# Altium project Dexter Pac.PrjPcb
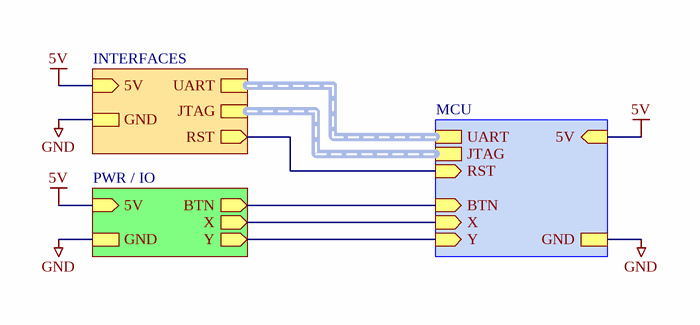
[diagram p0: Main.SchDoc]
Revision: 1
4 sheets, 50 parts. Net scope: hierarchical (ports join the sheet entries above them; power ports are global).
Board file: DexCon.PcbDoc
Sheets:
  Main.SchDoc
    MCU = MCU.SchDoc
    PWR / IO = INPUT.SchDoc
    INTERFACES = INTERFACE.SchDoc

## Sheet Main.SchDoc
size Letter; Revision: 1; SheetNumber: 1; SheetTotal: 4

### Sub-sheets
INTERFACES = INTERFACE.SchDoc: GND, 5V (in), UART (harness MCU_UART), RST (out), JTAG (harness MCU_SPI)
MCU = MCU.SchDoc: GND, 5V (in), X (in), BTN (in), Y (in), UART (harness MCU_UART), JTAG (harness MCU_SPI), RST (in)
PWR / IO = INPUT.SchDoc: GND, 5V (in), X (out), BTN (out), Y (out)

### Nets
5V: sheet MCU/5V, sheet PWR / IO/5V, sheet INTERFACES/5V
GND: sheet MCU/GND, sheet PWR / IO/GND, sheet INTERFACES/GND
RST: sheet MCU/RST, sheet INTERFACES/RST
NetC12_1: sheet MCU/BTN, sheet PWR / IO/BTN
NetR1_2: sheet MCU/X, sheet PWR / IO/X
NetR2_2: sheet MCU/Y, sheet PWR / IO/Y

### Buses and harness runs
harness sheet INTERFACES/JTAG = sheet MCU/JTAG
harness sheet INTERFACES/UART = sheet MCU/UART

### Notes on the sheet
- SHEET
- REVISION
- OF
- PROJECT
- REVIEWER
- ENGINEER
- DATE

## Sheet MCU.SchDoc
size Letter; SheetNumber: 2; SheetTotal: 4
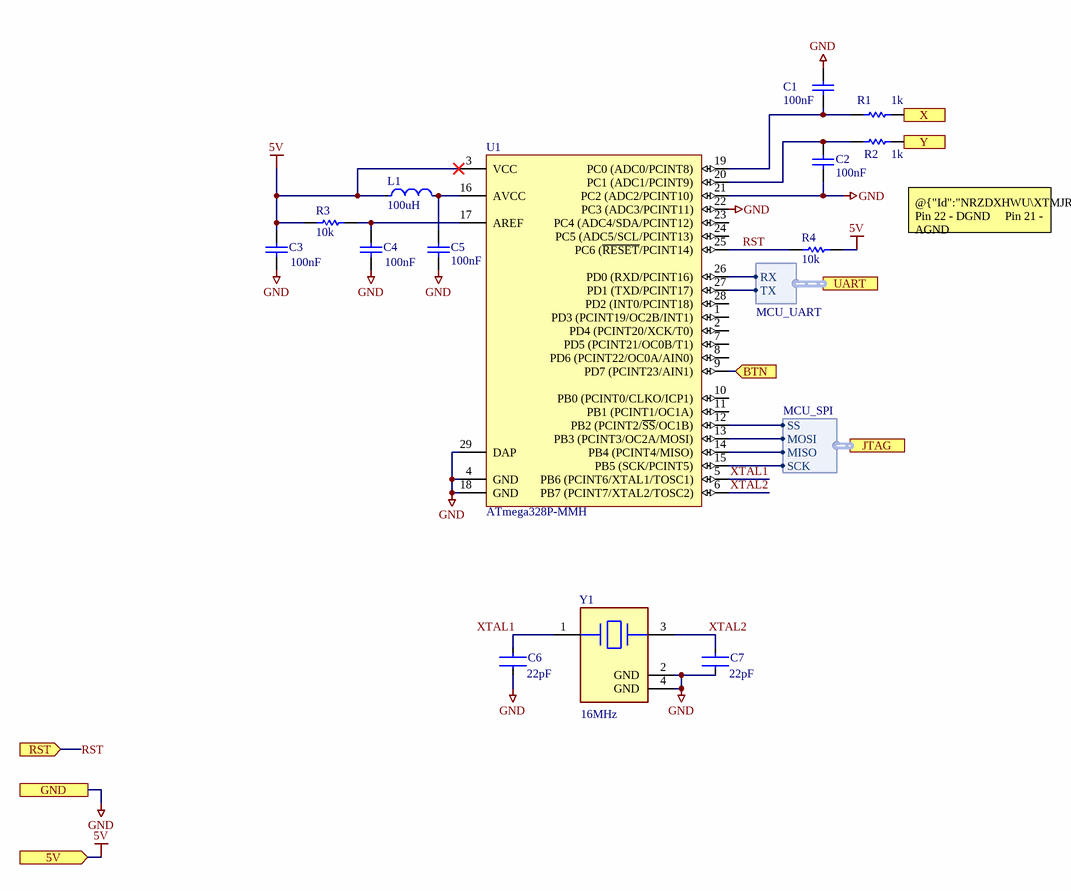
[diagram p1: MCU.SchDoc]

### Parts
C1  100nF  [CAPC1005X56X25ML10T15]
C2  100nF  [CAPC1005X56X25ML10T15]
C3  100nF  [CAPC1005X56X25ML10T15]
C4  100nF  [CAPC1005X56X25ML10T15]
C5  100nF  [CAPC1005X56X25ML10T15]
C6  C0805C220J5GACTU  [FP-C0805C-DN-MFG]  (value not drawn)
C7  C0805C220J5GACTU  [FP-C0805C-DN-MFG]  (value not drawn)
L1  100uH  [FP-CB3225-MFG]
R1  1k  [RESC1608X55X25ML10T15]
R2  1k  [RESC1608X55X25ML10T15]
R3  10k  [RESC1005X40X25LL05T05]
R4  10k  [RESC1005X40X25LL05T05]
U1  ATmega328P-MMH  [28M1_N]
Y1  ABM3B-16.000MHZ-10-1-U-T  [FP-ABM3B-MFG]  (value not drawn)

### Ports
5V (in), BTN (in), GND, JTAG (harness MCU_SPI), RST (in), UART (harness MCU_UART), X (in), Y (in)

### Harnesses
MCU_UART: RX, TX
MCU_SPI: MISO, SCK, MOSI, SS

### Nets
5V: C3.2 L1.1 R3.2 R4.1 U1.3(VCC) ; port 5V
GND: C1.2 C2.2 C3.1 C4.1 C5.2 C6.2 C7.2 U1.4(GND) U1.18(GND) U1.21(PC2_(ADC2/PCINT10)) U1.22(PC3_(ADC3/PCINT11)) U1.29(DAP) Y1.2(GND) Y1.4(GND) ; port GND
MISO: U1.14(PB4_(PCINT4/MISO)) ; port JTAG.MISO
MOSI: U1.13(PB3_(PCINT3/OC2A/MOSI)) ; port JTAG.MOSI
RST: R4.2 U1.25(PC6_(~{RESET}/PCINT14)) ; port RST
SCK: U1.15(PB5_(SCK/PCINT5)) ; port JTAG.SCK
U_N: U1.26(PD0_(RXD/PCINT16)) ; port UART.RX
U_P: U1.27(PD1_(TXD/PCINT17)) ; port UART.TX
XTAL1: C6.1 U1.5(PB6_(PCINT6/XTAL1/TOSC1)) Y1.1
XTAL2: C7.1 U1.6(PB7_(PCINT7/XTAL2/TOSC2)) Y1.3
NetC1_1: C1.1 R1.1 U1.19(PC0_(ADC0/PCINT8))
NetC2_1: C2.1 R2.1 U1.20(PC1_(ADC1/PCINT9))
NetC4_2: C4.2 R3.1 U1.17(AREF)
NetC5_1: C5.1 L1.2 U1.16(AVCC)
NetC12_1: U1.9(PD7_(PCINT23/AIN1)) ; port BTN
NetR1_2: R1.2 ; port X
NetR2_2: R2.2 ; port Y
NetU1_12: U1.12(PB2_(PCINT2/~{SS}/OC1B)) ; port JTAG.SS

Not connected (* = marked no-connect by the designer): U1 1(PD3_(PCINT19/OC2B/INT1)) 2(PD4_(PCINT20/XCK/T0)) 7(PD5_(PCINT21/OC0B/T1)) 8(PD6_(PCINT22/OC0A/AIN0)) 10(PB0_(PCINT0/CLKO/ICP1)) 11(PB1_(PCINT1/OC1A)) 23(PC4_(ADC4/SDA/PCINT12)) 24(PC5_(ADC5/SCL/PCINT13)) 28(PD2_(INT0/PCINT18))

### Notes on the sheet
- @{"Id":"NRZDXHWU\XTMJRJYD"} Pin 22 - DGND     Pin 21 - AGND
- (near C6) 22pF
- (near C7) 22pF
- (near Y1) 16MHz
- SHEET
- REVISION
- OF
- PROJECT
- REVIEWER
- ENGINEER
- DATE

### Library data of the parts
C1-C5 = CMP-1034-02071-2: Manufacturer: AVX Interconnect / Elco; Part Number: 0402YG104ZAT2A
C6 C7 = CMP-2007-00048-2: Capacitor; Ceramic; Cap; 22.0pF; Tol 5%; SMT; Vol-Rtg 50V; C0G; Tape and Reel; Manufacturer: KEMET; Temperature Coefficient: 30ppm/°C; Capacitance: 22 pF; Value: 22 pF; Tolerance: 0.05; Device Class L1: Passive Components; Mouser Description: Multilayer Ceramic Capacitors MLCC - SMD/SMT 50volts 22pF C0G 5%; Temperature Range Low: -55°C; Automotive: No; Voltage Rating: 50 V; Material: Ceramic; Category: Cap; Height: 0.88mm; Temperature Range High: +125°C; Digikey Description: Capacitor; Ceramic; Cap; 22.0pF; Tol 5%; SMT; Vol-Rtg 50V; C0G; Tape and Reel; Octopart: https://octopart.com/c0805c220j5gactu-kemet-145470; ComponentLink2Description: Datasheet; Device Class L2: Capacitors; Ipc Land Pattern Name: CAPC200125X78; RoHS: TRUE; ComponentLink2URL: https://content.kemet.com/datasheets/KEM_C1003_C0G_SMD.pdf; Temperature: -55°C to +125°C; Device Class L3: Ceramic Capacitors; Lead Free: Yes; Manufacturer Part Number: C0805C220J5GACTU; Temperature Characteristic: C0G; Package: C0805C-DN
L1 = CMP-14484-000373-1: SMD Inductors 100uH ±20% 0.34A 1.82Ω 1210; Resistance: 1.4R; DC Current: 340mA; DC Resistance (DCR): 1.82R; Saturation Current: 270mA; Self Resonant Frequency: 6MHz; Core Material: Ferrite; Inductor Type: POWER; Shielding: Unshielded; Test Frequency: 100kHz; Max Operating Temperature: 105°C; Length: 0.126inch; Inductance: 100uH; Current Rating: 340mA; Resistor Type: Wirewound; Halogen Free: Halogen Free; Height - Seated (Max): 0.106inch; Case/Package: 1210; Package Quantity: 1000; Lead Free: Lead Free; Series: CB; Tolerance: 20%; Depth: 2.7mm; Number of Pins: 2; Width: 0.098inch; Termination: SMD/SMT; Min Operating Temperature: -40°C; Max DC Current: 340mA; Inductance Tolerance: 20%; Radiation Hardening: No; Military Standard: Not; Height: 2.5mm; Case Code (Metric): 3225; Packaging: Tape and Reel; Mount: Surface Mount; RoHS Compliant: Yes; Case Code (Imperial): 1210
R1 R2 = CMP-2000-04525-1: Part Number: RT0603BRE071KL; Manufacturer: Yageo
R3 R4 = CMP-2000-07588-1: Chip Resistor, 10 KOhm, +/- 1%, 0.1 W, -55 to 155 degC, 0402 (1005 Metric), RoHS, Tape and Reel; Manufacturer: Panasonic; Power Rating: 100mW; Voltage Rating: 50V; Resistance: 10KOhm; Case\/Package: 0402; Temperature Coefficient: 100ppm\/degreesC; RoHSCompliant: True; Lead Free: LeadFree; Package Quantity: 1; Contact Plating: Tin; Length: 1mm; Radiation Hardening: No; REACH SVHC: NoSVHC; Max Operating Temperature: 155degC; Depth: 0.5mm; Case Code (Imperial): 0402; Military Standard: Not; Package Description: 2-Pin Surface Mount Device, Body 1 x 0.5 mm; Termination: SMD/SMT; Case Code (Metric): 1005; Height: 0.35mm; Packaging: TapeandReel; Voltage Rating (DC): 50V; Package Reference: 402; Number of Pins: 2; Tolerance: 1%; Mounting Technology: SurfaceMount; Width: 0.02inch; Mount: SurfaceMount; Datasheet URL: https://industrial.panasonic.com/cdbs/www-data/pdf/RDA0000/AOA0000C304.pdf; Composition: ThickFilm; Datasheet Version: 02/2017; Manufacturer URL: http://www.panasonic.com/; Max Power Dissipation: 100mW; Number of Terminations: 2; Min Operating Temperature: -55degC
U1 = CMP-0095-00378-1: 8-bit AVR Microcontroller, 32KB Flash, 1KB EEPROM, 2KB SRAM, 28-pin VQFN, Industrial Grade (-40°C to 85°C); ComponentLink2URL: http://www.atmel.com/dyn/resources/prod_documents/8271.pdf; ComponentLink2Description: ATmega48A/48PA/88A/88PA/168A/168PA/328/328P Datasheet; PackageReference: 28M1; ComponentLink3URL: http://www.atmel.com/dyn/resources/prod_documents/8271S.pdf; ComponentLink3Description: ATmega48A/48PA/88A/88PA/168A/168PA/328/328P Summary; PackageVersion: revB, Nov-2008; DatasheetVersion: revD, May-2011; PackageDescription: 28-pad, 4x4x1.0mm Body, Pitch 0.45mm, 2.4x2.4mm Exposed Pad, Plastic Very Thin QFN Package (VQFN); ComponentLink1URL: http://www.atmel.com/; ComponentLink1Description: Manufacturer URL
Y1 = CMP-27762-009701-1: Crystal 16MHz ±10ppm 10pF SMD-4 5mm x 3.2mm; Series Resistance: 50R; Package Quantity: 1000; Resistor Type: Ceramic; REACH SVHC: No SVHC; Load Capacitance: 10pF; Min Operating Temperature: -10°C; Depth: 3.2mm; ESR (Equivalent Series Resistance): 50R; Length: 5mm; Number of Pins: 4; Packaging: Tape and Reel; Tolerance: 10ppm; Operating Frequency: 16 MHz; Series: ABM3B; Frequency Stability: 10ppm; Height: 0.043inch; Lead Free: Lead Free; Case/Package: CSMD; Frequency: 16MHz; Max Operating Temperature: 60°C; Frequency Tolerance: 10ppm; Termination: SMD/SMT; Width: 3.2mm; Mount: Surface Mount

## Sheet INPUT.SchDoc
size Letter; SheetNumber: 4; SheetTotal: 4
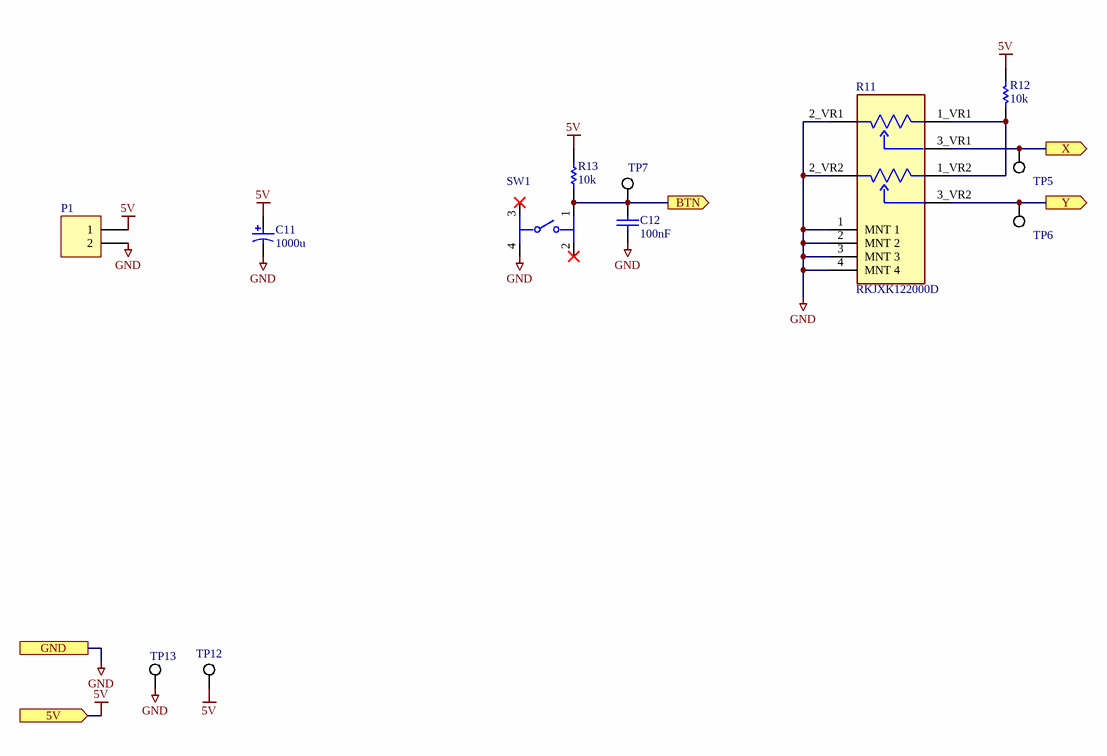
[diagram p2: INPUT.SchDoc]

### Parts
C11  1000u  [NIC-CAPA2-10X10_V]
C12  100nF  [CAPC1005X56X25ML10T15]
P1  Header 2  [HDR1X2]  (value not drawn)
R11  RKJXK122000D  [FP-RKJXK122000D-MFG]
R12  10k  [RESC1005X40X25LL05T05]
R13  10k  [RESC1005X40X25LL05T05]
SW1  PTS645SM43SMTR92LFS  [FP-PTS645SM43SMTR92LFS-MFG]  (value not drawn)
TP5  5019  [KSTN-5019_V]  (value not drawn)
TP6  5019  [KSTN-5019_V]  (value not drawn)
TP7  5019  [KSTN-5019_V]  (value not drawn)
TP12  5019  [KSTN-5019_V]  (value not drawn)
TP13  5019  [KSTN-5019_V]  (value not drawn)

### Ports
5V (in), BTN (out), GND, X (out), Y (out)

### Nets
5V: C11.1 P1.1 R12.2 R13.2 TP12.1 ; port 5V
GND: C11.2 C12.2 P1.2 R11.1(MNT_1) R11.2(MNT_2) R11.2_VR1(2_VR1) R11.2_VR2(2_VR2) R11.3(MNT_3) R11.4(MNT_4) SW1.4 TP13.1 ; port GND
NetC12_1: C12.1 R13.1 SW1.1 TP7.1 ; port BTN
NetR1_2: R11.3_VR1(3_VR1) TP5.1 ; port X
NetR2_2: R11.3_VR2(3_VR2) TP6.1 ; port Y
NetR11_1_VR1: R11.1_VR1(1_VR1) R11.1_VR2(1_VR2) R12.1

Not connected (* = marked no-connect by the designer): SW1 2* 3*

### Notes on the sheet
- SHEET
- REVISION
- OF
- PROJECT
- REVIEWER
- ENGINEER
- DATE

### Library data of the parts
C11 = CMP-0687-00006-1: Aluminum Electrolytic Capacitor, UD Series, Low Impedance, 1000 uF, 10 V, + / - 20%, -55 to 105 degC, Chip Type, 10 x 10 mm D x L, Pb-Free, Reel; Manufacturer: Nichicon; PartNumber: UUD1A102MNL1GS; Rated Voltage: 10 V; Rated Capacitance: 1000 uF; Endurance Time: 5000 h; Impedance: 0.09 Ohm; Packing: Dia382mm Reel; Tolerance Rated Capacitance: -20 to 20%; Rated Ripple Current (at 100kHz): 670 mA; DatasheetVersion: 08/2012; PackageReference: CAPAE-D10H10; PackageDescription: 2-Pin Surface Mount Device, Diameter 10 mm, Height 10 mm, Pitch 8 mm; ComponentLink3URL: http://products.nichicon.co.jp/en/pdf/XJA043/e-ud.pdf; ComponentLink2Description: Datasheet; Diameter: 10 mm; ComponentLink1Description: Manufacturer URL; RoHS: TRUE; ComponentLink2URL: http://products.nichicon.co.jp/en/pdf/XJA043/e-ud.pdf; Length: 10 mm; ComponentLink1URL: http://www.nichicon.co.jp/; Mounting Technology: Surface Mount; ComponentLink3Description: Package Specification
C12 = CMP-1034-02071-2: as C1 on sheet MCU
P1 = Header 2: Header, 2-Pin; LatestRevisionDate: 17-Jul-2002; LatestRevisionNote: Re-released for DXP Platform.; Publisher: Altium Limited
R11 = CMP-24118-000003-1: ALPS NAVIGATION SWITCH, RESISTIVE, PCB; Life (Hours): 100Hour; Operating Force: 5.2N; Resistance: 10kR; Insulation Resistance: 100MR; Power Rating: 12.5mW; Current Rating: 50mA; Lead Free: Lead Free; Mount: Through Hole; Resistor Type: Potentiometer; Min Operating Temperature: -10°C; Series: RKJXV/ RKJXK; Military Standard: Not; Width: 16mm; Length: 16mm; Max Operating Temperature: 70°C; Package Quantity: 10; Height: 12.9mm; Type: Potentiometer; Packaging: Tray; Radiation Hardening: No; Termination: Pin; RoHS Compliant: Yes; Depth: 20.7mm
R12 R13 = CMP-2000-07588-1: as R3 on sheet MCU; RoHSCompliant: True; Lead Free: LeadFree; Package Quantity: 1; Contact Plating: Tin; Length: 1mm; Radiation Hardening: No; REACH SVHC: NoSVHC; Max Operating Temperature: 155degC; Depth: 0.5mm; Case Code (Imperial): 0402; Military Standard: Not; Package Description: 2-Pin Surface Mount Device, Body 1 x 0.5 mm; Termination: SMD/SMT; Case Code (Metric): 1005; Height: 0.35mm; Packaging: TapeandReel; Voltage Rating (DC): 50V; Package Reference: 402; Number of Pins: 2; Tolerance: 1%; Mounting Technology: SurfaceMount; Width: 0.02inch; Mount: SurfaceMount; Datasheet URL: https://industrial.panasonic.com/cdbs/www-data/pdf/RDA0000/AOA0000C304.pdf; Composition: ThickFilm; Datasheet Version: 02/2017; Manufacturer URL: http://www.panasonic.com/; Max Power Dissipation: 100mW; Number of Terminations: 2; Min Operating Temperature: -55degC
SW1 = CMP-2000-05160-2: SWITCH TACTILE SPST-NO 0.05A 12V; Contact Resistance: 100mR; Throw Configuration: SPST; Illumination Type: Non-Illuminated; Mechanical Life: 100000Cycles; Current Rating: 50mA; Switch Function: Off-Mom; Actuator Length: 0.85mm; Actuator Material: Nylon; Actuator Type: Standard; Operating Force: 160gf; Min Operating Temperature: -20°C; REACH SVHC: No SVHC; Termination: Gull Wing; Case/Package: SMD/SMT; Packaging: Tape and Reel; Mount: Surface Mount; Voltage Rating (DC): 12V; Orientation: Straight; Lead Free: Lead Free; Contact Material: Silver; Color: Black; Max Current Rating: 50mA; Contact Plating: Silver; Depth: 9mm; Package Quantity: 1; Max Voltage Rating (DC): 12V; Length: 6mm; Max Operating Temperature: 60°C
TP5-TP7 TP12 TP13 = CMP-1672-00008-1: Test Point, 1 Position SMD, RoHS, Tape and Reel; ComponentLink1Description: Manufacturer URL; Package Quantity: 1000; DatasheetVersion: 03/2014; Packaging: Tape and Reel; ComponentLink2URL: http://www.keyelco.com/product-pdf.cfm?p=1357; ComponentLink1URL: http://www.keyelco.com/; Mount: Surface Mount; Contact Plating: Silver; PackageDescription: 1-Pin Surface Mount Device, Body 3.81 x 2.03 mm; Pins: 1; RoHSCompliant: True; Mounting Technology: Surface Mount; ComponentLink2Description: Datasheet; PackageReference: 5019

## Sheet INTERFACE.SchDoc
size Letter; SheetNumber: 3; SheetTotal: 4
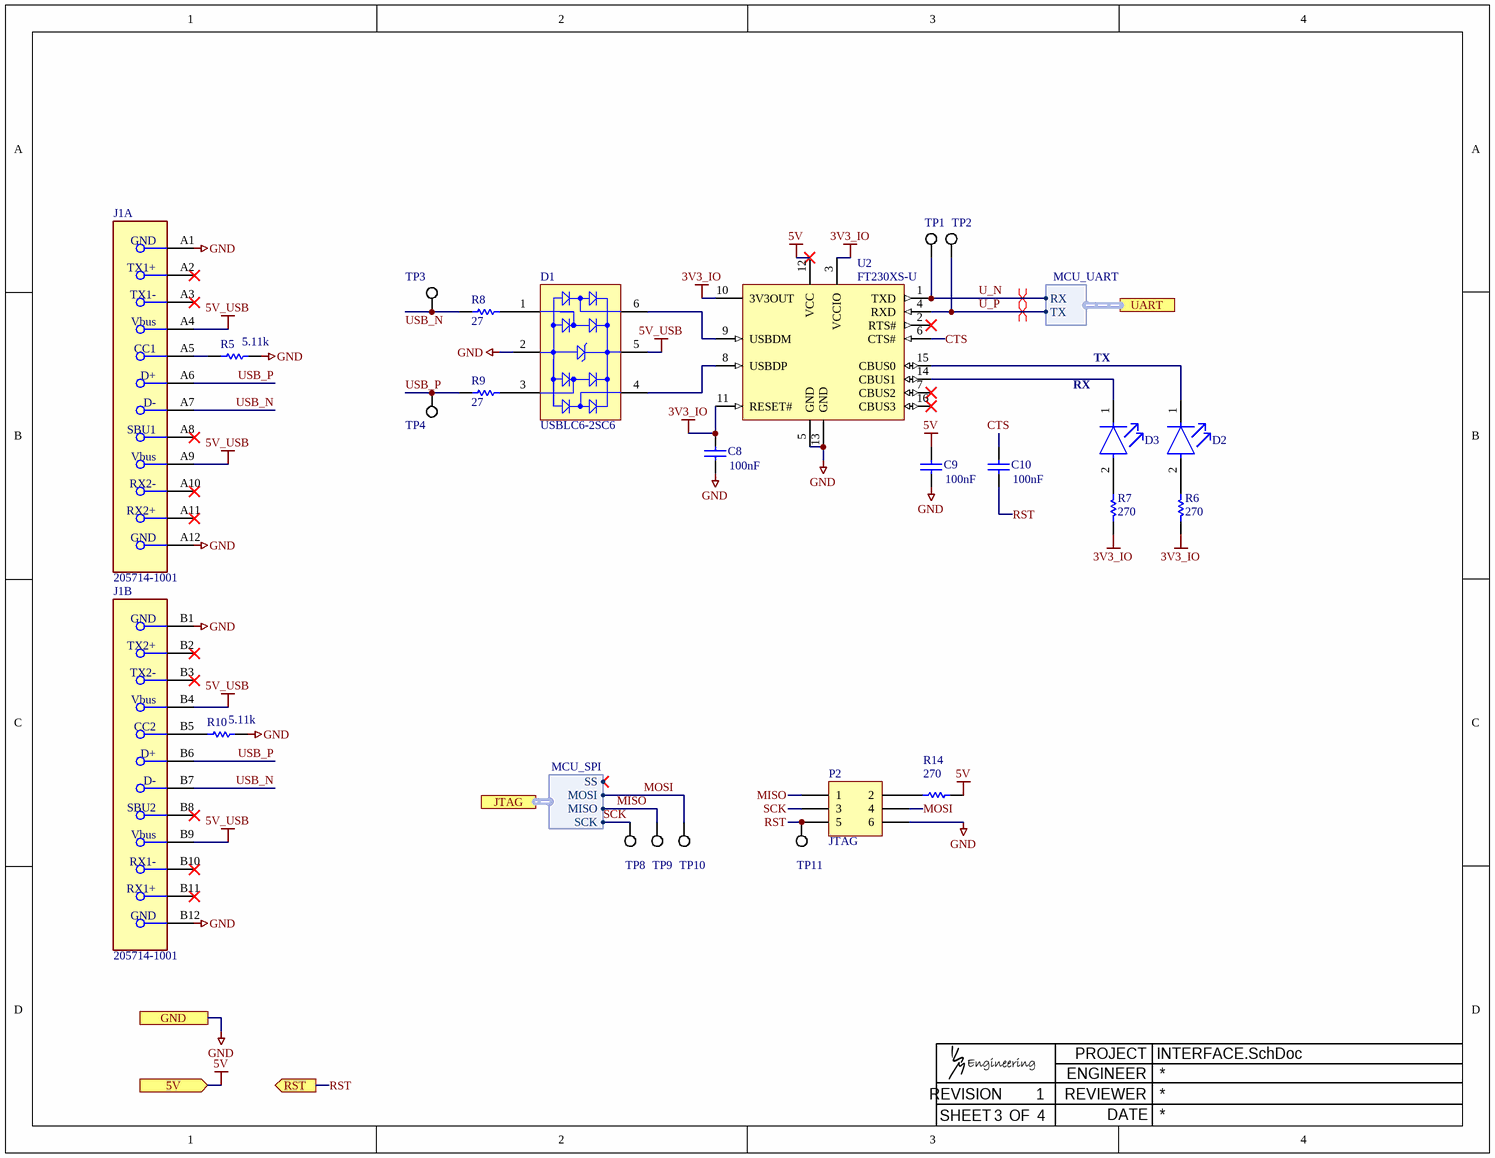
[diagram p3: INTERFACE.SchDoc]

### Parts
C8  100nF  [CAPC1005X56X25ML10T15]
C9  100nF  [CAPC1005X56X25ML10T15]
C10  100nF  [CAPC1005X56X25ML10T15]
D1  USBLC6-2SC6  [STM-SOT23-6L_V]
D2  LTST-C190KGKT  [FP-LTST-C190KGKT-MFG]  (value not drawn)
D3  LTST-C190KGKT  [FP-LTST-C190KGKT-MFG]  (value not drawn)
J1  205714-1001  [FP-205714-1001-MFG]  (parts A,B of 3)
P2  MHDR2X3  [MHDR2X3]  (value not drawn)
R5  5.11k  [RESC1005X40X25NL05T05]
R6  270  [RESC1005X40X25NL05T05]
R7  270  [RESC1005X40X25NL05T05]
R8  27  [RESC1005X40X25LL10T10]
R9  27  [RESC1005X40X25LL10T10]
R10  5.11k  [RESC1005X40X25NL05T05]
R14  270  [RESC1005X40X25NL05T05]
TP1  5019  [KSTN-5019_V]  (value not drawn)
TP2  5019  [KSTN-5019_V]  (value not drawn)
TP3  5019  [KSTN-5019_V]  (value not drawn)
TP4  5019  [KSTN-5019_V]  (value not drawn)
TP8  5019  [KSTN-5019_V]  (value not drawn)
TP9  5019  [KSTN-5019_V]  (value not drawn)
TP10  5019  [KSTN-5019_V]  (value not drawn)
TP11  5019  [KSTN-5019_V]  (value not drawn)
U2  FT230XS-U  [SSOP-16_N]

### Ports
5V (in), GND, JTAG (harness MCU_SPI), RST (out), UART (harness MCU_UART)

### Harnesses
MCU_UART: RX, TX
MCU_SPI: MISO, SCK, MOSI, SS

### Nets
3V3_IO: C8.2 R6.2 R7.2 U2.3(VCCIO) U2.10(3V3OUT) U2.11(RESET#)
5V: C9.2 R14.1 U2.12(VCC) ; port 5V
5V_USB: D1.5(VBUS) J1.A4(Vbus) J1.A9(Vbus) J1.B4(Vbus) J1.B9(Vbus)
GND: C8.1 C9.1 D1.2(GND) J1.A1(GND) J1.A12(GND) J1.B1(GND) J1.B12(GND) P2.6 R5.1 R10.1 U2.5(GND) U2.13(GND) ; port GND
CTS: C10.2 U2.6(CTS#)
MISO: P2.1 TP9.1 ; port JTAG.MISO
MOSI: P2.4 TP10.1 ; port JTAG.MOSI
RST: C10.1 P2.5 TP11.1 ; port RST
SCK: P2.3 TP8.1 ; port JTAG.SCK
U_N: TP1.1 U2.1(TXD) ; port UART.RX
U_P: TP2.1 U2.4(RXD) ; port UART.TX
USB_N: J1.A7(D-) J1.B7(D-) R8.1 TP3.1
USB_P: J1.A6(D+) J1.B6(D+) R9.1 TP4.1
NetD1_1: D1.1(I/O_1) R8.2
NetD1_3: D1.3(I/O_2) R9.2
NetD1_4: D1.4(I/O_3) U2.8(USBDP)
NetD1_6: D1.6(I/O_4) U2.9(USBDM)
NetD2_1: D2.1(C) U2.15(CBUS0)
NetD2_2: D2.2(A) R6.1
NetD3_1: D3.1(C) U2.14(CBUS1)
NetD3_2: D3.2(A) R7.1
NetJ1_A5: J1.A5(CC1) R5.2
NetJ1_B5: J1.B5(CC2) R10.2
NetP2_2: P2.2 R14.2

Not connected (* = marked no-connect by the designer): J1 A2(TX1+)* A3(TX1-)* A8(SBU1)* A10(RX2-)* A11(RX2+)* B2(TX2+)* B3(TX2-)* B8(SBU2)* B10(RX1-)* B11(RX1+)*; U2 2(RTS#)* 7(CBUS2)* 16(CBUS3)*

### Layout directives
differential pair: U_N, U_P

### Notes on the sheet
- TX
- (near D3) RX
- (near P2) JTAG
- SHEET
- REVISION
- OF
- PROJECT
- REVIEWER
- ENGINEER
- DATE

### Library data of the parts
C8-C10 = CMP-1034-02071-2: as C1 on sheet MCU
D1 = CMP-2000-05378-1: Very low capacitance ESD protection, 3.5 pF, -40 to 125 degC, 6-Pin SOT23, RoHS, Tape and Reel; Manufacturer: STMicroelectronics; Polarity: Uni-Directional; Clamping Voltage: 17V; Rad Hardened: No; Product Height (mm): 1.3mm; Leakage Current (Max): 0.15uA; Product Length (mm): 3.05mm; Number of Elements: 1; Peak Pulse Current: 5A; Configuration: Dual; Reverse Breakdown Voltage: 6V; Working Voltage (Max): 5V; Capacitance Value: 3.5pF; Suppressor Type: DiodeArrays; Product Depth (mm): 1.75mm; Test Current (It): 1mA; Package / Case: SOT-23; Operating Temperature Max Deg. C: 125C; Package Description: 6-Pin Small Outline Transistor, Body 2.925 x 1.625 mm, Pitch 0.95 mm; Package Reference: SOT23-6L; Datasheet Version: Rev. 5, 10/2011; Operating Temperature Min Deg. C: -40C; Mounting Style: SurfaceMount; Direction Type: Uni-Directional; Mounting: SurfaceMount; Pin Count: 6; Leakage Current: 0.15uA; Packaging: TapeandReel; Operating Temperature Classification: Automotive; Clamping Voltage (Max): 17V; Manufacturer URL: http://www.st.com/; Reverse Stand-off Voltage: 5V; Datasheet URL: http://www.st.com/st-web-ui/static/active/en/resource/technical/document/datasheet/CD00050750.pdf; Working Voltage: 5V; Operating Temp Range: -40Cto125C
D2 D3 = CMP-2000-05197-2: LED GREEN CLEAR CHIP SMD; Test Current: 20mA; Power Rating: 75mW; Forward Voltage: 2V; Wavelength: 574nm; Number of LEDs: 1; Reverse Voltage: 5V; Dominant Wavelength: 571nm; Lens Style: Diffused; Luminous Intensity: 35mcd; Forward Current: 30mA; Viewing Angle: 130°; Lens Color: Colorless; Width: 0.8mm; Case Code (Imperial): 0603; Case Code (Metric): 1608; Number of Pins: 2; Radiation Hardening: No; Package Quantity: 1; Lead Free: Lead Free; Lens Transparency: Clear; Depth: 0.8mm; Power Dissipation: 75mW; Mount: Surface Mount; Max Operating Temperature: 85°C; Case/Package: 0603; Height: 0.8mm; Illumination Color: Green; Color: Green; Length: 1.6mm; Packaging: Tape and Reel; Number of Elements: 1; Min Operating Temperature: -55°C
J1 = CMP-04767-000031-1: USB TYPE C WITH SCREW HOLE  GM
P2 = MHDR2X3: Header, 3-Pin, Dual row; LatestRevisionDate: 17-Jul-2002; LatestRevisionNote: Re-released for DXP Platform.; Publisher: Altium Limited
R5 R10 = CMP-2002-00974-1: Manufacturer: Panasonic; Part Number: ERJ-2RKF5111X
R6 R7 R14 = CMP-1011-00444-2: Part Number: ERJ2RKF2700X; Manufacturer: Panasonic
R8 R9 = CMP-2002-03638-1: Part Number: RK73B1ETTP270J; Manufacturer: KOA Speer
TP1-TP4 TP8-TP11 = CMP-1672-00008-1: as TP5 on sheet INPUT; ComponentLink1Description: Manufacturer URL; Package Quantity: 1000; DatasheetVersion: 03/2014; Packaging: Tape and Reel; ComponentLink2URL: http://www.keyelco.com/product-pdf.cfm?p=1357; ComponentLink1URL: http://www.keyelco.com/; Mount: Surface Mount; Contact Plating: Silver; PackageDescription: 1-Pin Surface Mount Device, Body 3.81 x 2.03 mm; Pins: 1; RoHSCompliant: True; Mounting Technology: Surface Mount; ComponentLink2Description: Datasheet; PackageReference: 5019
U2 = CMP-0248-00025-2: USB to Basic UART Interface Chip, UHCI/OHCI/EHCI Compatible, USB 2.0 Compatible, -40 to +85 degC, 16-Pin SSOP, Pb-Free, Tube; Manufacturer: FTDI; PackageDescription: 16-Pin Small Outline Package, 8.6 x 3.9 mm Body, 0.635 mm Pitch; ComponentLink2URL: http://www.ftdichip.com/Support/Documents/DataSheets/ICs/DS_FT230X.pdf; ComponentLink3URL: www.ftdichip.com/Products/ICs/FT230X.html; PartNumber: FT230XS-U; RevisionNote: DatasheetVersion updated to 1.2 Feb-2013; PackageVersion: Feb-13; ComponentLink2Description: Datasheet; Code_JEDEC: MO-137-AB; DatasheetVersion: ver 1.2, Feb-2013; ComponentLink1URL: http://www.ftdichip.com/; PackageReference: SSOP-16; ComponentLink1Description: Manufacturer URL; ComponentLink3Description: FT230X Product Page

## Nets that join several sheets
5V: MCU (5 pins), INPUT (5 pins), INTERFACE (C9.2 R14.1 U2.12)
GND: MCU (14 pins), INPUT (11 pins), INTERFACE (12 pins)
MISO: MCU (U1.14), INTERFACE (P2.1 TP9.1)
MOSI: MCU (U1.13), INTERFACE (P2.4 TP10.1)
NetC12_1: MCU (U1.9), INPUT (C12.1 R13.1 SW1.1 TP7.1)
NetR1_2: MCU (R1.2), INPUT (R11.3_VR1 TP5.1)
NetR2_2: MCU (R2.2), INPUT (R11.3_VR2 TP6.1)
RST: MCU (R4.2 U1.25), INTERFACE (C10.1 P2.5 TP11.1)
SCK: MCU (U1.15), INTERFACE (P2.3 TP8.1)
U_N: MCU (U1.26), INTERFACE (TP1.1 U2.1)
U_P: MCU (U1.27), INTERFACE (TP2.1 U2.4)